# Vivado block design CE_128TR, xczu19eg-ffvc1760-2-i, Vivado 2024.2
# (continued, part 2 of 7)
current_bd_instance /EstNoise

create_bd_cell -type ip -vlnv xilinx.com:ip:xlconstant:1.1 gnd1
set_property -dict {CONFIG.CONST_VAL 0 CONFIG.CONST_WIDTH 1} [get_bd_cells gnd1]
create_bd_cell -type module -reference EstNoise EstNoise_0
set_property -dict {CONFIG.PARA 16 CONFIG.PORT 2} [get_bd_cells EstNoise_0]
create_bd_cell -type module -reference EstNoise EstNoise_1
set_property -dict {CONFIG.PARA 16 CONFIG.PORT 2} [get_bd_cells EstNoise_1]
create_bd_cell -type module -reference EstNoise EstNoise_2
set_property -dict {CONFIG.PARA 16 CONFIG.PORT 2} [get_bd_cells EstNoise_2]
create_bd_cell -type module -reference EstNoise EstNoise_3
set_property -dict {CONFIG.PARA 16 CONFIG.PORT 2} [get_bd_cells EstNoise_3]
create_bd_cell -type module -reference EstNoise EstNoise_4
set_property -dict {CONFIG.PARA 16 CONFIG.PORT 2} [get_bd_cells EstNoise_4]
create_bd_cell -type module -reference EstNoise EstNoise_5
set_property -dict {CONFIG.PARA 16 CONFIG.PORT 2} [get_bd_cells EstNoise_5]
create_bd_cell -type module -reference EstNoise EstNoise_6
set_property -dict {CONFIG.PARA 16 CONFIG.PORT 2} [get_bd_cells EstNoise_6]
create_bd_cell -type module -reference EstNoise EstNoise_7
set_property -dict {CONFIG.PARA 16 CONFIG.PORT 2} [get_bd_cells EstNoise_7]

# ---- hierarchy /Aveg_noise ----
current_bd_instance /Aveg_noise
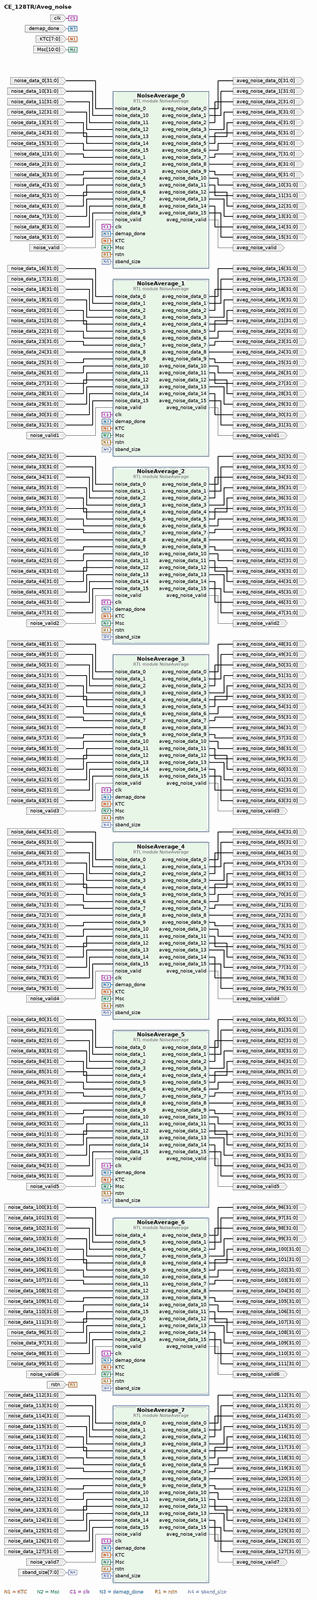
[diagram p20: block diagram inside /Aveg_noise, whole]
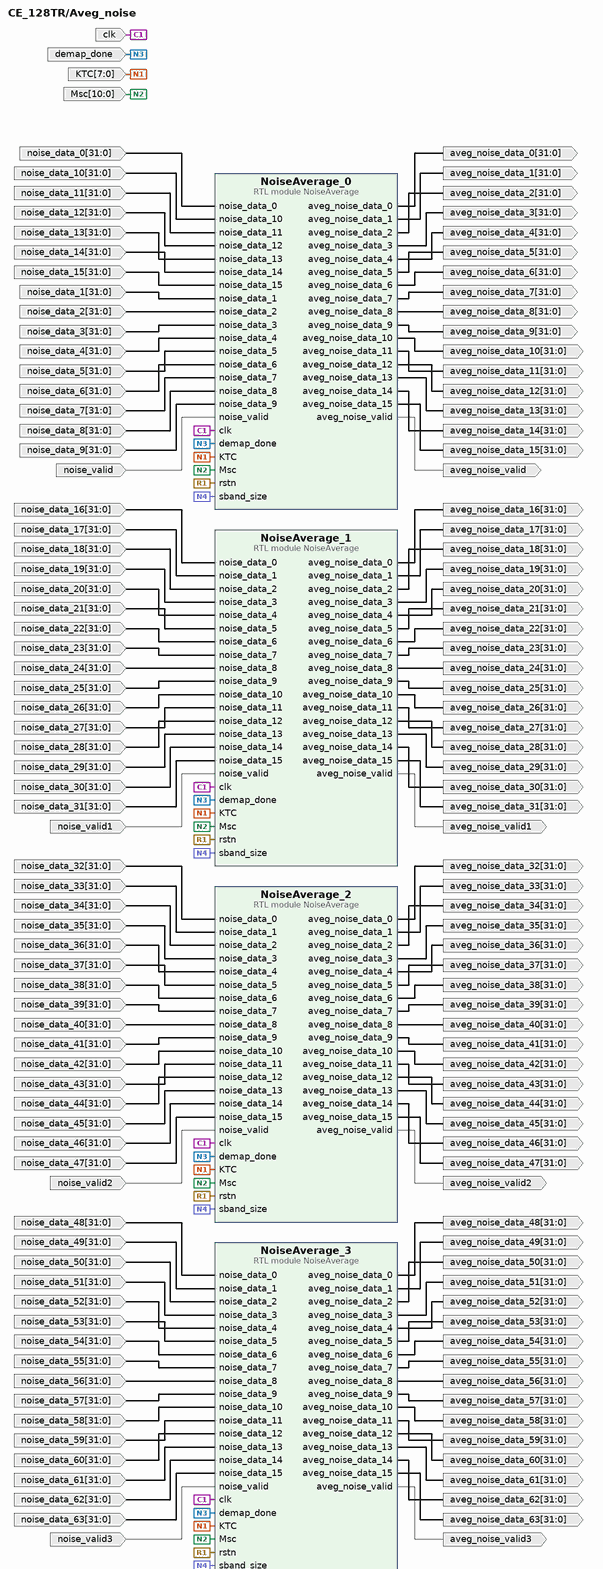
[diagram p21: block diagram inside /Aveg_noise, upper part]
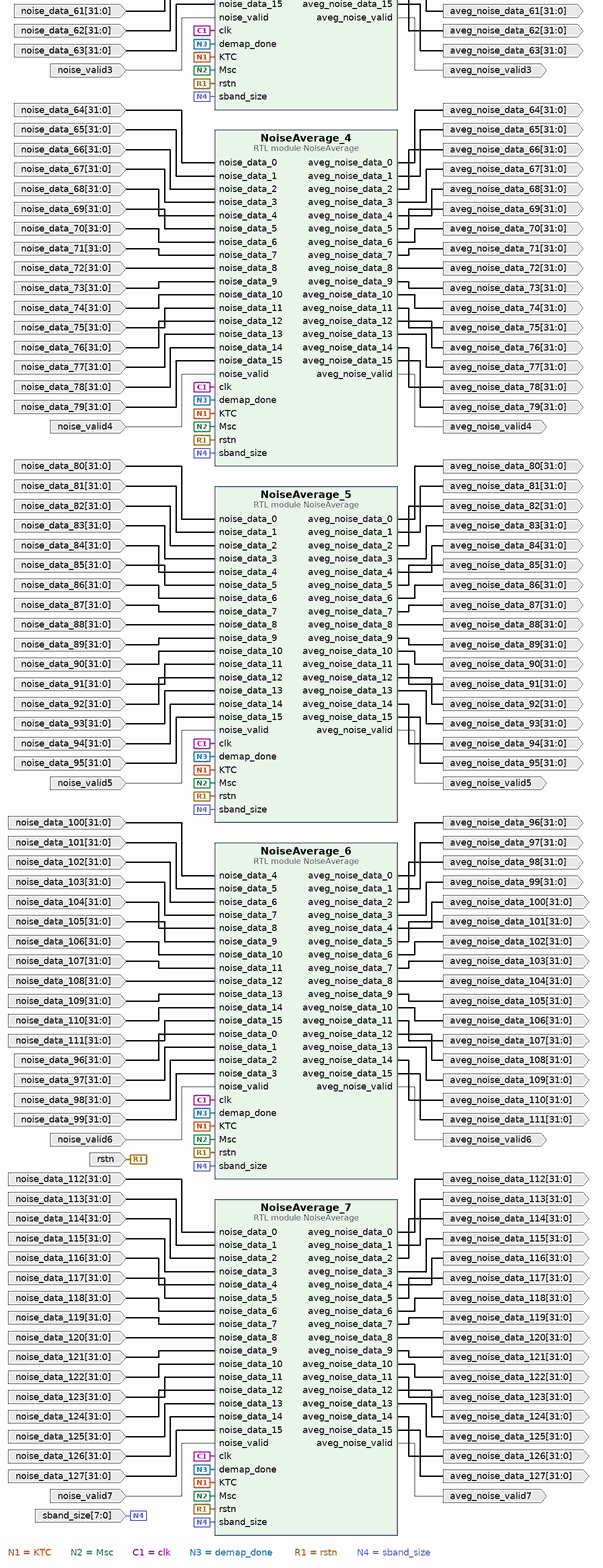
[diagram p22: block diagram inside /Aveg_noise, lower part]
create_bd_pin -dir I -type clk clk
create_bd_pin -dir I -type rst rstn
create_bd_pin -dir I demap_done
create_bd_pin -dir I -from 7 -to 0 sband_size
create_bd_pin -dir I -from 7 -to 0 KTC
create_bd_pin -dir I -from 10 -to 0 Msc
create_bd_pin -dir I noise_valid
create_bd_pin -dir I -from 31 -to 0 noise_data_0
create_bd_pin -dir I -from 31 -to 0 noise_data_1
create_bd_pin -dir I -from 31 -to 0 noise_data_2
create_bd_pin -dir I -from 31 -to 0 noise_data_3
create_bd_pin -dir I -from 31 -to 0 noise_data_4
create_bd_pin -dir I -from 31 -to 0 noise_data_5
create_bd_pin -dir I -from 31 -to 0 noise_data_6
create_bd_pin -dir I -from 31 -to 0 noise_data_7
create_bd_pin -dir I -from 31 -to 0 noise_data_8
create_bd_pin -dir I -from 31 -to 0 noise_data_9
create_bd_pin -dir I -from 31 -to 0 noise_data_10
create_bd_pin -dir I -from 31 -to 0 noise_data_11
create_bd_pin -dir I -from 31 -to 0 noise_data_12
create_bd_pin -dir I -from 31 -to 0 noise_data_13
create_bd_pin -dir I -from 31 -to 0 noise_data_14
create_bd_pin -dir I -from 31 -to 0 noise_data_15
create_bd_pin -dir I noise_valid1
create_bd_pin -dir I -from 31 -to 0 noise_data_16
create_bd_pin -dir I -from 31 -to 0 noise_data_17
create_bd_pin -dir I -from 31 -to 0 noise_data_18
create_bd_pin -dir I -from 31 -to 0 noise_data_19
create_bd_pin -dir I -from 31 -to 0 noise_data_20
create_bd_pin -dir I -from 31 -to 0 noise_data_21
create_bd_pin -dir I -from 31 -to 0 noise_data_22
create_bd_pin -dir I -from 31 -to 0 noise_data_23
create_bd_pin -dir I -from 31 -to 0 noise_data_24
create_bd_pin -dir I -from 31 -to 0 noise_data_25
create_bd_pin -dir I -from 31 -to 0 noise_data_26
create_bd_pin -dir I -from 31 -to 0 noise_data_27
create_bd_pin -dir I -from 31 -to 0 noise_data_28
create_bd_pin -dir I -from 31 -to 0 noise_data_29
create_bd_pin -dir I -from 31 -to 0 noise_data_30
create_bd_pin -dir I -from 31 -to 0 noise_data_31
create_bd_pin -dir I noise_valid2
create_bd_pin -dir I -from 31 -to 0 noise_data_32
create_bd_pin -dir I -from 31 -to 0 noise_data_33
create_bd_pin -dir I -from 31 -to 0 noise_data_34
create_bd_pin -dir I -from 31 -to 0 noise_data_35
create_bd_pin -dir I -from 31 -to 0 noise_data_36
create_bd_pin -dir I -from 31 -to 0 noise_data_37
create_bd_pin -dir I -from 31 -to 0 noise_data_38
create_bd_pin -dir I -from 31 -to 0 noise_data_39
create_bd_pin -dir I -from 31 -to 0 noise_data_40
create_bd_pin -dir I -from 31 -to 0 noise_data_41
create_bd_pin -dir I -from 31 -to 0 noise_data_42
create_bd_pin -dir I -from 31 -to 0 noise_data_43
create_bd_pin -dir I -from 31 -to 0 noise_data_44
create_bd_pin -dir I -from 31 -to 0 noise_data_45
create_bd_pin -dir I -from 31 -to 0 noise_data_46
create_bd_pin -dir I -from 31 -to 0 noise_data_47
create_bd_pin -dir I noise_valid3
create_bd_pin -dir I -from 31 -to 0 noise_data_48
create_bd_pin -dir I -from 31 -to 0 noise_data_49
create_bd_pin -dir I -from 31 -to 0 noise_data_50
create_bd_pin -dir I -from 31 -to 0 noise_data_51
create_bd_pin -dir I -from 31 -to 0 noise_data_52
create_bd_pin -dir I -from 31 -to 0 noise_data_53
create_bd_pin -dir I -from 31 -to 0 noise_data_54
create_bd_pin -dir I -from 31 -to 0 noise_data_55
create_bd_pin -dir I -from 31 -to 0 noise_data_56
create_bd_pin -dir I -from 31 -to 0 noise_data_57
create_bd_pin -dir I -from 31 -to 0 noise_data_58
create_bd_pin -dir I -from 31 -to 0 noise_data_59
create_bd_pin -dir I -from 31 -to 0 noise_data_60
create_bd_pin -dir I -from 31 -to 0 noise_data_61
create_bd_pin -dir I -from 31 -to 0 noise_data_62
create_bd_pin -dir I -from 31 -to 0 noise_data_63
create_bd_pin -dir I noise_valid4
create_bd_pin -dir I -from 31 -to 0 noise_data_64
create_bd_pin -dir I -from 31 -to 0 noise_data_65
create_bd_pin -dir I -from 31 -to 0 noise_data_66
create_bd_pin -dir I -from 31 -to 0 noise_data_67
create_bd_pin -dir I -from 31 -to 0 noise_data_68
create_bd_pin -dir I -from 31 -to 0 noise_data_69
create_bd_pin -dir I -from 31 -to 0 noise_data_70
create_bd_pin -dir I -from 31 -to 0 noise_data_71
create_bd_pin -dir I -from 31 -to 0 noise_data_72
create_bd_pin -dir I -from 31 -to 0 noise_data_73
create_bd_pin -dir I -from 31 -to 0 noise_data_74
create_bd_pin -dir I -from 31 -to 0 noise_data_75
create_bd_pin -dir I -from 31 -to 0 noise_data_76
create_bd_pin -dir I -from 31 -to 0 noise_data_77
create_bd_pin -dir I -from 31 -to 0 noise_data_78
create_bd_pin -dir I -from 31 -to 0 noise_data_79
create_bd_pin -dir I noise_valid5
create_bd_pin -dir I -from 31 -to 0 noise_data_80
create_bd_pin -dir I -from 31 -to 0 noise_data_81
create_bd_pin -dir I -from 31 -to 0 noise_data_82
create_bd_pin -dir I -from 31 -to 0 noise_data_83
create_bd_pin -dir I -from 31 -to 0 noise_data_84
create_bd_pin -dir I -from 31 -to 0 noise_data_85
create_bd_pin -dir I -from 31 -to 0 noise_data_86
create_bd_pin -dir I -from 31 -to 0 noise_data_87
create_bd_pin -dir I -from 31 -to 0 noise_data_88
create_bd_pin -dir I -from 31 -to 0 noise_data_89
create_bd_pin -dir I -from 31 -to 0 noise_data_90
create_bd_pin -dir I -from 31 -to 0 noise_data_91
create_bd_pin -dir I -from 31 -to 0 noise_data_92
create_bd_pin -dir I -from 31 -to 0 noise_data_93
create_bd_pin -dir I -from 31 -to 0 noise_data_94
create_bd_pin -dir I -from 31 -to 0 noise_data_95
create_bd_pin -dir I noise_valid6
create_bd_pin -dir I -from 31 -to 0 noise_data_96
create_bd_pin -dir I -from 31 -to 0 noise_data_97
create_bd_pin -dir I -from 31 -to 0 noise_data_98
create_bd_pin -dir I -from 31 -to 0 noise_data_99
create_bd_pin -dir I -from 31 -to 0 noise_data_100
create_bd_pin -dir I -from 31 -to 0 noise_data_101
create_bd_pin -dir I -from 31 -to 0 noise_data_102
create_bd_pin -dir I -from 31 -to 0 noise_data_103
create_bd_pin -dir I -from 31 -to 0 noise_data_104
create_bd_pin -dir I -from 31 -to 0 noise_data_105
create_bd_pin -dir I -from 31 -to 0 noise_data_106
create_bd_pin -dir I -from 31 -to 0 noise_data_107
create_bd_pin -dir I -from 31 -to 0 noise_data_108
create_bd_pin -dir I -from 31 -to 0 noise_data_109
create_bd_pin -dir I -from 31 -to 0 noise_data_110
create_bd_pin -dir I -from 31 -to 0 noise_data_111
create_bd_pin -dir I noise_valid7
create_bd_pin -dir I -from 31 -to 0 noise_data_112
create_bd_pin -dir I -from 31 -to 0 noise_data_113
create_bd_pin -dir I -from 31 -to 0 noise_data_114
create_bd_pin -dir I -from 31 -to 0 noise_data_115
create_bd_pin -dir I -from 31 -to 0 noise_data_116
create_bd_pin -dir I -from 31 -to 0 noise_data_117
create_bd_pin -dir I -from 31 -to 0 noise_data_118
create_bd_pin -dir I -from 31 -to 0 noise_data_119
create_bd_pin -dir I -from 31 -to 0 noise_data_120
create_bd_pin -dir I -from 31 -to 0 noise_data_121
create_bd_pin -dir I -from 31 -to 0 noise_data_122
create_bd_pin -dir I -from 31 -to 0 noise_data_123
create_bd_pin -dir I -from 31 -to 0 noise_data_124
create_bd_pin -dir I -from 31 -to 0 noise_data_125
create_bd_pin -dir I -from 31 -to 0 noise_data_126
create_bd_pin -dir I -from 31 -to 0 noise_data_127
create_bd_pin -dir O aveg_noise_valid
create_bd_pin -dir O -from 31 -to 0 aveg_noise_data_0
create_bd_pin -dir O -from 31 -to 0 aveg_noise_data_1
create_bd_pin -dir O -from 31 -to 0 aveg_noise_data_2
create_bd_pin -dir O -from 31 -to 0 aveg_noise_data_3
create_bd_pin -dir O -from 31 -to 0 aveg_noise_data_4
create_bd_pin -dir O -from 31 -to 0 aveg_noise_data_5
create_bd_pin -dir O -from 31 -to 0 aveg_noise_data_6
create_bd_pin -dir O -from 31 -to 0 aveg_noise_data_7
create_bd_pin -dir O -from 31 -to 0 aveg_noise_data_8
create_bd_pin -dir O -from 31 -to 0 aveg_noise_data_9
create_bd_pin -dir O -from 31 -to 0 aveg_noise_data_10
create_bd_pin -dir O -from 31 -to 0 aveg_noise_data_11
create_bd_pin -dir O -from 31 -to 0 aveg_noise_data_12
create_bd_pin -dir O -from 31 -to 0 aveg_noise_data_13
create_bd_pin -dir O -from 31 -to 0 aveg_noise_data_14
create_bd_pin -dir O -from 31 -to 0 aveg_noise_data_15
create_bd_pin -dir O aveg_noise_valid1
create_bd_pin -dir O -from 31 -to 0 aveg_noise_data_16
create_bd_pin -dir O -from 31 -to 0 aveg_noise_data_17
create_bd_pin -dir O -from 31 -to 0 aveg_noise_data_18
create_bd_pin -dir O -from 31 -to 0 aveg_noise_data_19
create_bd_pin -dir O -from 31 -to 0 aveg_noise_data_20
create_bd_pin -dir O -from 31 -to 0 aveg_noise_data_21
create_bd_pin -dir O -from 31 -to 0 aveg_noise_data_22
create_bd_pin -dir O -from 31 -to 0 aveg_noise_data_23
create_bd_pin -dir O -from 31 -to 0 aveg_noise_data_24
create_bd_pin -dir O -from 31 -to 0 aveg_noise_data_25
create_bd_pin -dir O -from 31 -to 0 aveg_noise_data_26
create_bd_pin -dir O -from 31 -to 0 aveg_noise_data_27
create_bd_pin -dir O -from 31 -to 0 aveg_noise_data_28
create_bd_pin -dir O -from 31 -to 0 aveg_noise_data_29
create_bd_pin -dir O -from 31 -to 0 aveg_noise_data_30
create_bd_pin -dir O -from 31 -to 0 aveg_noise_data_31
create_bd_pin -dir O aveg_noise_valid2
create_bd_pin -dir O -from 31 -to 0 aveg_noise_data_32
create_bd_pin -dir O -from 31 -to 0 aveg_noise_data_33
create_bd_pin -dir O -from 31 -to 0 aveg_noise_data_34
create_bd_pin -dir O -from 31 -to 0 aveg_noise_data_35
create_bd_pin -dir O -from 31 -to 0 aveg_noise_data_36
create_bd_pin -dir O -from 31 -to 0 aveg_noise_data_37
create_bd_pin -dir O -from 31 -to 0 aveg_noise_data_38
create_bd_pin -dir O -from 31 -to 0 aveg_noise_data_39
create_bd_pin -dir O -from 31 -to 0 aveg_noise_data_40
create_bd_pin -dir O -from 31 -to 0 aveg_noise_data_41
create_bd_pin -dir O -from 31 -to 0 aveg_noise_data_42
create_bd_pin -dir O -from 31 -to 0 aveg_noise_data_43
create_bd_pin -dir O -from 31 -to 0 aveg_noise_data_44
create_bd_pin -dir O -from 31 -to 0 aveg_noise_data_45
create_bd_pin -dir O -from 31 -to 0 aveg_noise_data_46
create_bd_pin -dir O -from 31 -to 0 aveg_noise_data_47
create_bd_pin -dir O aveg_noise_valid3
create_bd_pin -dir O -from 31 -to 0 aveg_noise_data_48
create_bd_pin -dir O -from 31 -to 0 aveg_noise_data_49
create_bd_pin -dir O -from 31 -to 0 aveg_noise_data_50
create_bd_pin -dir O -from 31 -to 0 aveg_noise_data_51
create_bd_pin -dir O -from 31 -to 0 aveg_noise_data_52
create_bd_pin -dir O -from 31 -to 0 aveg_noise_data_53
create_bd_pin -dir O -from 31 -to 0 aveg_noise_data_54
create_bd_pin -dir O -from 31 -to 0 aveg_noise_data_55
create_bd_pin -dir O -from 31 -to 0 aveg_noise_data_56
create_bd_pin -dir O -from 31 -to 0 aveg_noise_data_57
create_bd_pin -dir O -from 31 -to 0 aveg_noise_data_58
create_bd_pin -dir O -from 31 -to 0 aveg_noise_data_59
create_bd_pin -dir O -from 31 -to 0 aveg_noise_data_60
create_bd_pin -dir O -from 31 -to 0 aveg_noise_data_61
create_bd_pin -dir O -from 31 -to 0 aveg_noise_data_62
create_bd_pin -dir O -from 31 -to 0 aveg_noise_data_63
create_bd_pin -dir O aveg_noise_valid4
create_bd_pin -dir O -from 31 -to 0 aveg_noise_data_64
create_bd_pin -dir O -from 31 -to 0 aveg_noise_data_65
create_bd_pin -dir O -from 31 -to 0 aveg_noise_data_66
create_bd_pin -dir O -from 31 -to 0 aveg_noise_data_67
create_bd_pin -dir O -from 31 -to 0 aveg_noise_data_68
create_bd_pin -dir O -from 31 -to 0 aveg_noise_data_69
create_bd_pin -dir O -from 31 -to 0 aveg_noise_data_70
create_bd_pin -dir O -from 31 -to 0 aveg_noise_data_71
create_bd_pin -dir O -from 31 -to 0 aveg_noise_data_72
create_bd_pin -dir O -from 31 -to 0 aveg_noise_data_73
create_bd_pin -dir O -from 31 -to 0 aveg_noise_data_74
create_bd_pin -dir O -from 31 -to 0 aveg_noise_data_75
create_bd_pin -dir O -from 31 -to 0 aveg_noise_data_76
create_bd_pin -dir O -from 31 -to 0 aveg_noise_data_77
create_bd_pin -dir O -from 31 -to 0 aveg_noise_data_78
create_bd_pin -dir O -from 31 -to 0 aveg_noise_data_79
create_bd_pin -dir O aveg_noise_valid5
create_bd_pin -dir O -from 31 -to 0 aveg_noise_data_80
create_bd_pin -dir O -from 31 -to 0 aveg_noise_data_81
create_bd_pin -dir O -from 31 -to 0 aveg_noise_data_82
create_bd_pin -dir O -from 31 -to 0 aveg_noise_data_83
create_bd_pin -dir O -from 31 -to 0 aveg_noise_data_84
create_bd_pin -dir O -from 31 -to 0 aveg_noise_data_85
create_bd_pin -dir O -from 31 -to 0 aveg_noise_data_86
create_bd_pin -dir O -from 31 -to 0 aveg_noise_data_87
create_bd_pin -dir O -from 31 -to 0 aveg_noise_data_88
create_bd_pin -dir O -from 31 -to 0 aveg_noise_data_89
create_bd_pin -dir O -from 31 -to 0 aveg_noise_data_90
create_bd_pin -dir O -from 31 -to 0 aveg_noise_data_91
create_bd_pin -dir O -from 31 -to 0 aveg_noise_data_92
create_bd_pin -dir O -from 31 -to 0 aveg_noise_data_93
create_bd_pin -dir O -from 31 -to 0 aveg_noise_data_94
create_bd_pin -dir O -from 31 -to 0 aveg_noise_data_95
create_bd_pin -dir O aveg_noise_valid6
create_bd_pin -dir O -from 31 -to 0 aveg_noise_data_96
create_bd_pin -dir O -from 31 -to 0 aveg_noise_data_97
create_bd_pin -dir O -from 31 -to 0 aveg_noise_data_98
create_bd_pin -dir O -from 31 -to 0 aveg_noise_data_99
create_bd_pin -dir O -from 31 -to 0 aveg_noise_data_100
create_bd_pin -dir O -from 31 -to 0 aveg_noise_data_101
create_bd_pin -dir O -from 31 -to 0 aveg_noise_data_102
create_bd_pin -dir O -from 31 -to 0 aveg_noise_data_103
create_bd_pin -dir O -from 31 -to 0 aveg_noise_data_104
create_bd_pin -dir O -from 31 -to 0 aveg_noise_data_105
create_bd_pin -dir O -from 31 -to 0 aveg_noise_data_106
create_bd_pin -dir O -from 31 -to 0 aveg_noise_data_107
create_bd_pin -dir O -from 31 -to 0 aveg_noise_data_108
create_bd_pin -dir O -from 31 -to 0 aveg_noise_data_109
create_bd_pin -dir O -from 31 -to 0 aveg_noise_data_110
create_bd_pin -dir O -from 31 -to 0 aveg_noise_data_111
create_bd_pin -dir O aveg_noise_valid7
create_bd_pin -dir O -from 31 -to 0 aveg_noise_data_112
create_bd_pin -dir O -from 31 -to 0 aveg_noise_data_113
create_bd_pin -dir O -from 31 -to 0 aveg_noise_data_114
create_bd_pin -dir O -from 31 -to 0 aveg_noise_data_115
create_bd_pin -dir O -from 31 -to 0 aveg_noise_data_116
create_bd_pin -dir O -from 31 -to 0 aveg_noise_data_117
create_bd_pin -dir O -from 31 -to 0 aveg_noise_data_118
create_bd_pin -dir O -from 31 -to 0 aveg_noise_data_119
create_bd_pin -dir O -from 31 -to 0 aveg_noise_data_120
create_bd_pin -dir O -from 31 -to 0 aveg_noise_data_121
create_bd_pin -dir O -from 31 -to 0 aveg_noise_data_122
create_bd_pin -dir O -from 31 -to 0 aveg_noise_data_123
create_bd_pin -dir O -from 31 -to 0 aveg_noise_data_124
create_bd_pin -dir O -from 31 -to 0 aveg_noise_data_125
create_bd_pin -dir O -from 31 -to 0 aveg_noise_data_126
create_bd_pin -dir O -from 31 -to 0 aveg_noise_data_127

create_bd_cell -type module -reference NoiseAverage NoiseAverage_0
set_property -dict {CONFIG.PARA 16} [get_bd_cells NoiseAverage_0]
create_bd_cell -type module -reference NoiseAverage NoiseAverage_1
set_property -dict {CONFIG.PARA 16} [get_bd_cells NoiseAverage_1]
create_bd_cell -type module -reference NoiseAverage NoiseAverage_2
set_property -dict {CONFIG.PARA 16} [get_bd_cells NoiseAverage_2]
create_bd_cell -type module -reference NoiseAverage NoiseAverage_3
set_property -dict {CONFIG.PARA 16} [get_bd_cells NoiseAverage_3]
create_bd_cell -type module -reference NoiseAverage NoiseAverage_4
set_property -dict {CONFIG.PARA 16} [get_bd_cells NoiseAverage_4]
create_bd_cell -type module -reference NoiseAverage NoiseAverage_5
set_property -dict {CONFIG.PARA 16} [get_bd_cells NoiseAverage_5]
create_bd_cell -type module -reference NoiseAverage NoiseAverage_6
set_property -dict {CONFIG.PARA 16} [get_bd_cells NoiseAverage_6]
create_bd_cell -type module -reference NoiseAverage NoiseAverage_7
set_property -dict {CONFIG.PARA 16} [get_bd_cells NoiseAverage_7]

# ---- hierarchy /ChannelNorm ----
current_bd_instance /ChannelNorm
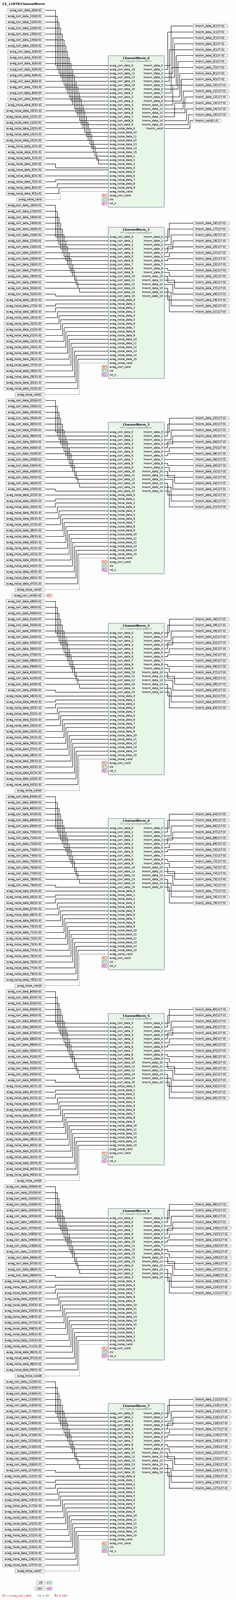
[diagram p23: block diagram inside /ChannelNorm, whole]
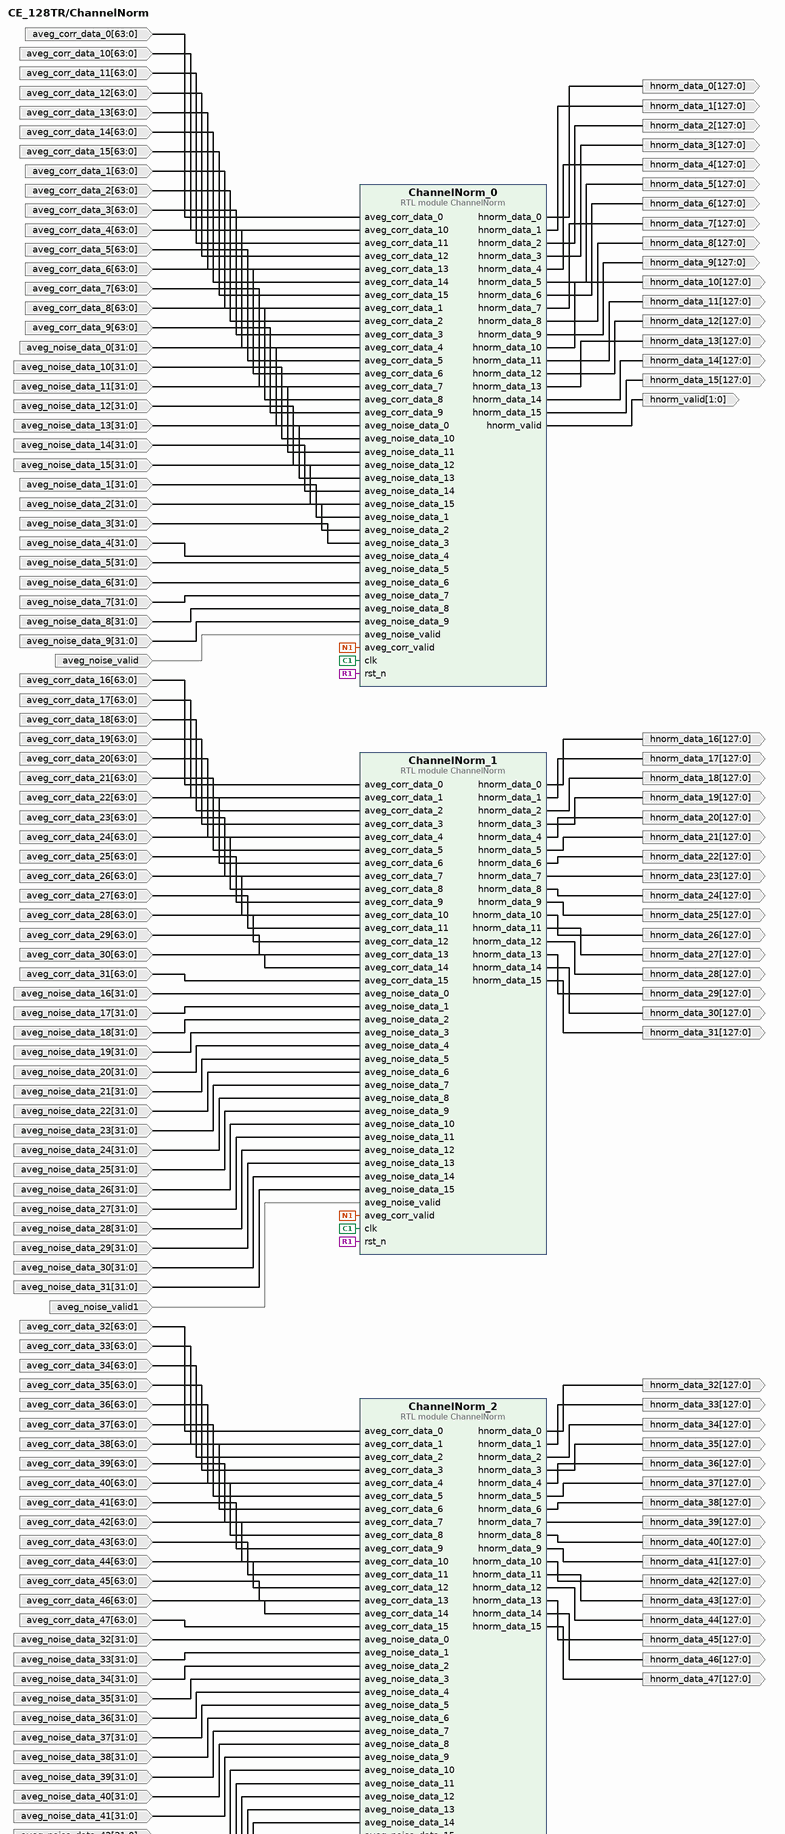
[diagram p24: block diagram inside /ChannelNorm, upper part]
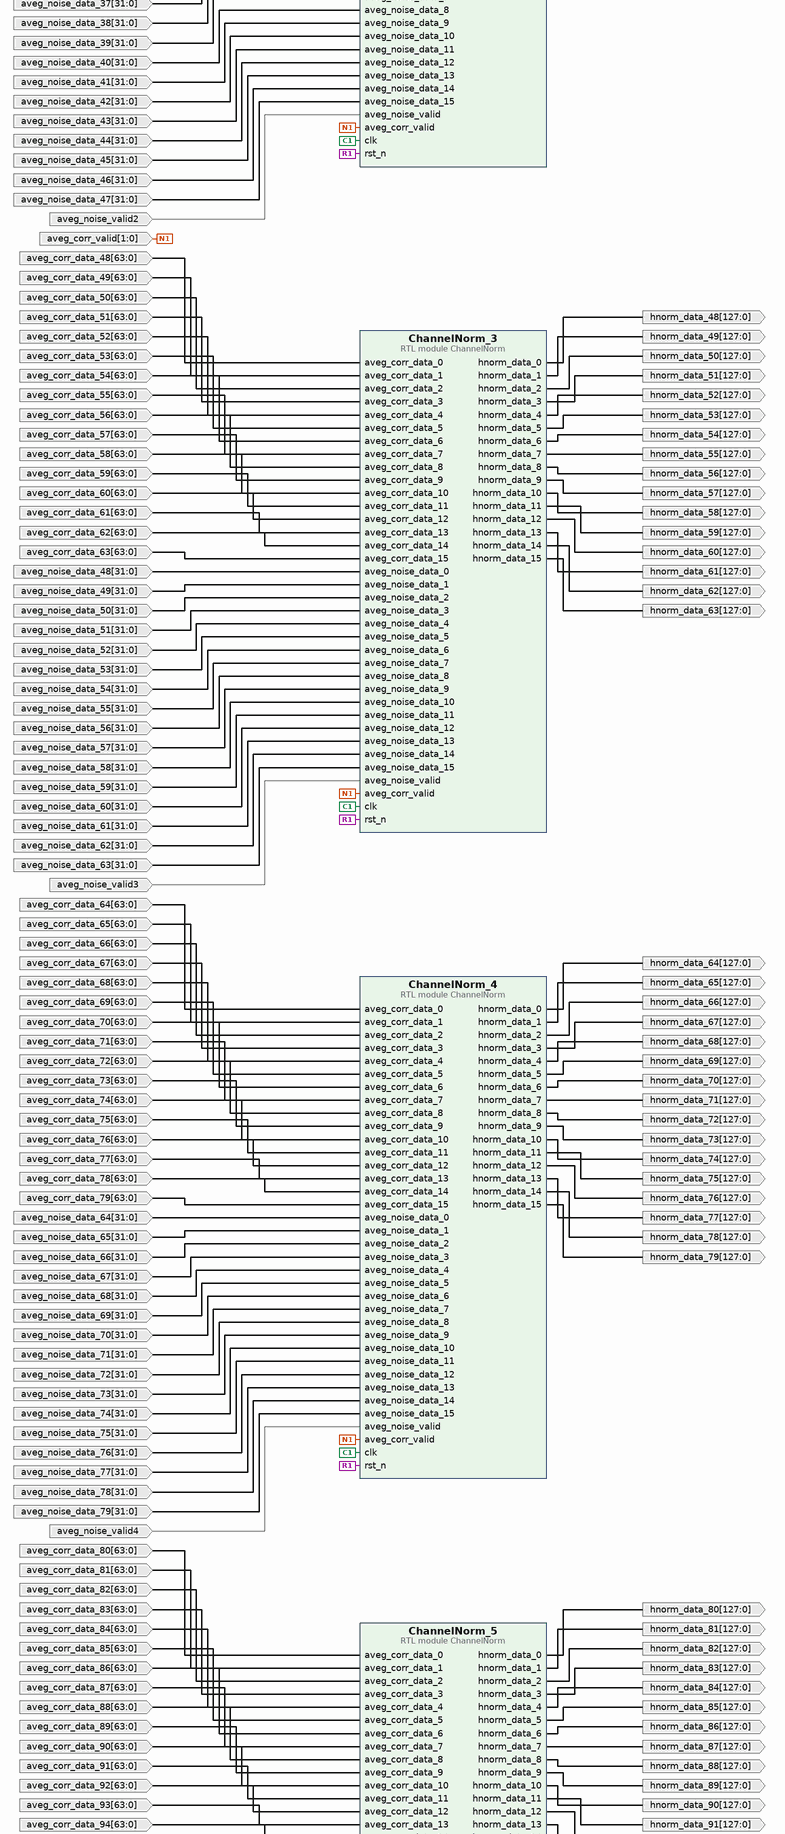
[diagram p25: block diagram inside /ChannelNorm, middle part]
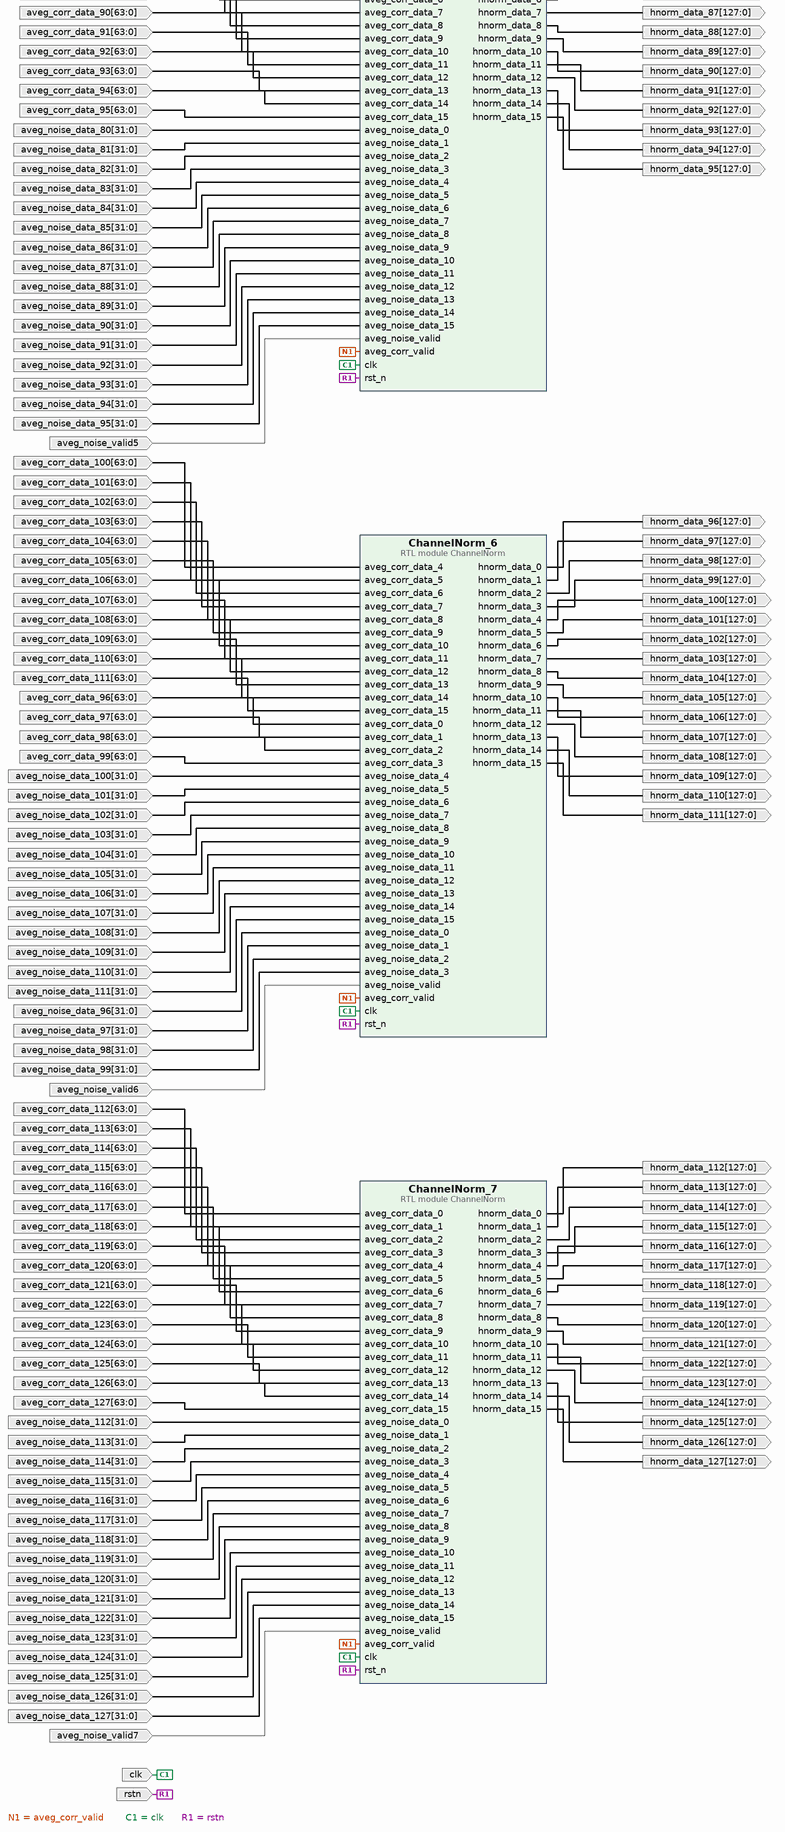
[diagram p26: block diagram inside /ChannelNorm, lower part]
create_bd_pin -dir I -type clk clk
create_bd_pin -dir I -type rst rstn
create_bd_pin -dir I -from 1 -to 0 aveg_corr_valid
create_bd_pin -dir I -from 63 -to 0 aveg_corr_data_0
create_bd_pin -dir I -from 63 -to 0 aveg_corr_data_1
create_bd_pin -dir I -from 63 -to 0 aveg_corr_data_2
create_bd_pin -dir I -from 63 -to 0 aveg_corr_data_3
create_bd_pin -dir I -from 63 -to 0 aveg_corr_data_4
create_bd_pin -dir I -from 63 -to 0 aveg_corr_data_5
create_bd_pin -dir I -from 63 -to 0 aveg_corr_data_6
create_bd_pin -dir I -from 63 -to 0 aveg_corr_data_7
create_bd_pin -dir I -from 63 -to 0 aveg_corr_data_8
create_bd_pin -dir I -from 63 -to 0 aveg_corr_data_9
create_bd_pin -dir I -from 63 -to 0 aveg_corr_data_10
create_bd_pin -dir I -from 63 -to 0 aveg_corr_data_11
create_bd_pin -dir I -from 63 -to 0 aveg_corr_data_12
create_bd_pin -dir I -from 63 -to 0 aveg_corr_data_13
create_bd_pin -dir I -from 63 -to 0 aveg_corr_data_14
create_bd_pin -dir I -from 63 -to 0 aveg_corr_data_15
create_bd_pin -dir I aveg_noise_valid
create_bd_pin -dir I -from 31 -to 0 aveg_noise_data_0
create_bd_pin -dir I -from 31 -to 0 aveg_noise_data_1
create_bd_pin -dir I -from 31 -to 0 aveg_noise_data_2
create_bd_pin -dir I -from 31 -to 0 aveg_noise_data_3
create_bd_pin -dir I -from 31 -to 0 aveg_noise_data_4
create_bd_pin -dir I -from 31 -to 0 aveg_noise_data_5
create_bd_pin -dir I -from 31 -to 0 aveg_noise_data_6
create_bd_pin -dir I -from 31 -to 0 aveg_noise_data_7
create_bd_pin -dir I -from 31 -to 0 aveg_noise_data_8
create_bd_pin -dir I -from 31 -to 0 aveg_noise_data_9
create_bd_pin -dir I -from 31 -to 0 aveg_noise_data_10
create_bd_pin -dir I -from 31 -to 0 aveg_noise_data_11
create_bd_pin -dir I -from 31 -to 0 aveg_noise_data_12
create_bd_pin -dir I -from 31 -to 0 aveg_noise_data_13
create_bd_pin -dir I -from 31 -to 0 aveg_noise_data_14
create_bd_pin -dir I -from 31 -to 0 aveg_noise_data_15
create_bd_pin -dir I -from 63 -to 0 aveg_corr_data_16
create_bd_pin -dir I -from 63 -to 0 aveg_corr_data_17
create_bd_pin -dir I -from 63 -to 0 aveg_corr_data_18
create_bd_pin -dir I -from 63 -to 0 aveg_corr_data_19
create_bd_pin -dir I -from 63 -to 0 aveg_corr_data_20
create_bd_pin -dir I -from 63 -to 0 aveg_corr_data_21
create_bd_pin -dir I -from 63 -to 0 aveg_corr_data_22
create_bd_pin -dir I -from 63 -to 0 aveg_corr_data_23
create_bd_pin -dir I -from 63 -to 0 aveg_corr_data_24
create_bd_pin -dir I -from 63 -to 0 aveg_corr_data_25
create_bd_pin -dir I -from 63 -to 0 aveg_corr_data_26
create_bd_pin -dir I -from 63 -to 0 aveg_corr_data_27
create_bd_pin -dir I -from 63 -to 0 aveg_corr_data_28
create_bd_pin -dir I -from 63 -to 0 aveg_corr_data_29
create_bd_pin -dir I -from 63 -to 0 aveg_corr_data_30
create_bd_pin -dir I -from 63 -to 0 aveg_corr_data_31
create_bd_pin -dir I aveg_noise_valid1
create_bd_pin -dir I -from 31 -to 0 aveg_noise_data_16
create_bd_pin -dir I -from 31 -to 0 aveg_noise_data_17
create_bd_pin -dir I -from 31 -to 0 aveg_noise_data_18
create_bd_pin -dir I -from 31 -to 0 aveg_noise_data_19
create_bd_pin -dir I -from 31 -to 0 aveg_noise_data_20
create_bd_pin -dir I -from 31 -to 0 aveg_noise_data_21
create_bd_pin -dir I -from 31 -to 0 aveg_noise_data_22
create_bd_pin -dir I -from 31 -to 0 aveg_noise_data_23
create_bd_pin -dir I -from 31 -to 0 aveg_noise_data_24
create_bd_pin -dir I -from 31 -to 0 aveg_noise_data_25
create_bd_pin -dir I -from 31 -to 0 aveg_noise_data_26
create_bd_pin -dir I -from 31 -to 0 aveg_noise_data_27
create_bd_pin -dir I -from 31 -to 0 aveg_noise_data_28
create_bd_pin -dir I -from 31 -to 0 aveg_noise_data_29
create_bd_pin -dir I -from 31 -to 0 aveg_noise_data_30
create_bd_pin -dir I -from 31 -to 0 aveg_noise_data_31
create_bd_pin -dir I -from 63 -to 0 aveg_corr_data_32
create_bd_pin -dir I -from 63 -to 0 aveg_corr_data_33
create_bd_pin -dir I -from 63 -to 0 aveg_corr_data_34
create_bd_pin -dir I -from 63 -to 0 aveg_corr_data_35
create_bd_pin -dir I -from 63 -to 0 aveg_corr_data_36
create_bd_pin -dir I -from 63 -to 0 aveg_corr_data_37
create_bd_pin -dir I -from 63 -to 0 aveg_corr_data_38
create_bd_pin -dir I -from 63 -to 0 aveg_corr_data_39
create_bd_pin -dir I -from 63 -to 0 aveg_corr_data_40
create_bd_pin -dir I -from 63 -to 0 aveg_corr_data_41
create_bd_pin -dir I -from 63 -to 0 aveg_corr_data_42
create_bd_pin -dir I -from 63 -to 0 aveg_corr_data_43
create_bd_pin -dir I -from 63 -to 0 aveg_corr_data_44
create_bd_pin -dir I -from 63 -to 0 aveg_corr_data_45
create_bd_pin -dir I -from 63 -to 0 aveg_corr_data_46
create_bd_pin -dir I -from 63 -to 0 aveg_corr_data_47
create_bd_pin -dir I aveg_noise_valid2
create_bd_pin -dir I -from 31 -to 0 aveg_noise_data_32
create_bd_pin -dir I -from 31 -to 0 aveg_noise_data_33
create_bd_pin -dir I -from 31 -to 0 aveg_noise_data_34
create_bd_pin -dir I -from 31 -to 0 aveg_noise_data_35
create_bd_pin -dir I -from 31 -to 0 aveg_noise_data_36
create_bd_pin -dir I -from 31 -to 0 aveg_noise_data_37
create_bd_pin -dir I -from 31 -to 0 aveg_noise_data_38
create_bd_pin -dir I -from 31 -to 0 aveg_noise_data_39
create_bd_pin -dir I -from 31 -to 0 aveg_noise_data_40
create_bd_pin -dir I -from 31 -to 0 aveg_noise_data_41
create_bd_pin -dir I -from 31 -to 0 aveg_noise_data_42
create_bd_pin -dir I -from 31 -to 0 aveg_noise_data_43
create_bd_pin -dir I -from 31 -to 0 aveg_noise_data_44
create_bd_pin -dir I -from 31 -to 0 aveg_noise_data_45
create_bd_pin -dir I -from 31 -to 0 aveg_noise_data_46
create_bd_pin -dir I -from 31 -to 0 aveg_noise_data_47
create_bd_pin -dir I -from 63 -to 0 aveg_corr_data_48
create_bd_pin -dir I -from 63 -to 0 aveg_corr_data_49
create_bd_pin -dir I -from 63 -to 0 aveg_corr_data_50
create_bd_pin -dir I -from 63 -to 0 aveg_corr_data_51
create_bd_pin -dir I -from 63 -to 0 aveg_corr_data_52
create_bd_pin -dir I -from 63 -to 0 aveg_corr_data_53
create_bd_pin -dir I -from 63 -to 0 aveg_corr_data_54
create_bd_pin -dir I -from 63 -to 0 aveg_corr_data_55
create_bd_pin -dir I -from 63 -to 0 aveg_corr_data_56
create_bd_pin -dir I -from 63 -to 0 aveg_corr_data_57
create_bd_pin -dir I -from 63 -to 0 aveg_corr_data_58
create_bd_pin -dir I -from 63 -to 0 aveg_corr_data_59
create_bd_pin -dir I -from 63 -to 0 aveg_corr_data_60
create_bd_pin -dir I -from 63 -to 0 aveg_corr_data_61
create_bd_pin -dir I -from 63 -to 0 aveg_corr_data_62
create_bd_pin -dir I -from 63 -to 0 aveg_corr_data_63
create_bd_pin -dir I aveg_noise_valid3
create_bd_pin -dir I -from 31 -to 0 aveg_noise_data_48
create_bd_pin -dir I -from 31 -to 0 aveg_noise_data_49
create_bd_pin -dir I -from 31 -to 0 aveg_noise_data_50
create_bd_pin -dir I -from 31 -to 0 aveg_noise_data_51
create_bd_pin -dir I -from 31 -to 0 aveg_noise_data_52
create_bd_pin -dir I -from 31 -to 0 aveg_noise_data_53
create_bd_pin -dir I -from 31 -to 0 aveg_noise_data_54
create_bd_pin -dir I -from 31 -to 0 aveg_noise_data_55
create_bd_pin -dir I -from 31 -to 0 aveg_noise_data_56
create_bd_pin -dir I -from 31 -to 0 aveg_noise_data_57
create_bd_pin -dir I -from 31 -to 0 aveg_noise_data_58
create_bd_pin -dir I -from 31 -to 0 aveg_noise_data_59
create_bd_pin -dir I -from 31 -to 0 aveg_noise_data_60
create_bd_pin -dir I -from 31 -to 0 aveg_noise_data_61
create_bd_pin -dir I -from 31 -to 0 aveg_noise_data_62
create_bd_pin -dir I -from 31 -to 0 aveg_noise_data_63
create_bd_pin -dir I -from 63 -to 0 aveg_corr_data_64
create_bd_pin -dir I -from 63 -to 0 aveg_corr_data_65
create_bd_pin -dir I -from 63 -to 0 aveg_corr_data_66
create_bd_pin -dir I -from 63 -to 0 aveg_corr_data_67
create_bd_pin -dir I -from 63 -to 0 aveg_corr_data_68
create_bd_pin -dir I -from 63 -to 0 aveg_corr_data_69
create_bd_pin -dir I -from 63 -to 0 aveg_corr_data_70
create_bd_pin -dir I -from 63 -to 0 aveg_corr_data_71
create_bd_pin -dir I -from 63 -to 0 aveg_corr_data_72
create_bd_pin -dir I -from 63 -to 0 aveg_corr_data_73
create_bd_pin -dir I -from 63 -to 0 aveg_corr_data_74
create_bd_pin -dir I -from 63 -to 0 aveg_corr_data_75
create_bd_pin -dir I -from 63 -to 0 aveg_corr_data_76
create_bd_pin -dir I -from 63 -to 0 aveg_corr_data_77
create_bd_pin -dir I -from 63 -to 0 aveg_corr_data_78
create_bd_pin -dir I -from 63 -to 0 aveg_corr_data_79
create_bd_pin -dir I aveg_noise_valid4
create_bd_pin -dir I -from 31 -to 0 aveg_noise_data_64
create_bd_pin -dir I -from 31 -to 0 aveg_noise_data_65
create_bd_pin -dir I -from 31 -to 0 aveg_noise_data_66
create_bd_pin -dir I -from 31 -to 0 aveg_noise_data_67
create_bd_pin -dir I -from 31 -to 0 aveg_noise_data_68
create_bd_pin -dir I -from 31 -to 0 aveg_noise_data_69
create_bd_pin -dir I -from 31 -to 0 aveg_noise_data_70
create_bd_pin -dir I -from 31 -to 0 aveg_noise_data_71
create_bd_pin -dir I -from 31 -to 0 aveg_noise_data_72
create_bd_pin -dir I -from 31 -to 0 aveg_noise_data_73
create_bd_pin -dir I -from 31 -to 0 aveg_noise_data_74
create_bd_pin -dir I -from 31 -to 0 aveg_noise_data_75
create_bd_pin -dir I -from 31 -to 0 aveg_noise_data_76
create_bd_pin -dir I -from 31 -to 0 aveg_noise_data_77
create_bd_pin -dir I -from 31 -to 0 aveg_noise_data_78
create_bd_pin -dir I -from 31 -to 0 aveg_noise_data_79
create_bd_pin -dir I -from 63 -to 0 aveg_corr_data_80
create_bd_pin -dir I -from 63 -to 0 aveg_corr_data_81
create_bd_pin -dir I -from 63 -to 0 aveg_corr_data_82
create_bd_pin -dir I -from 63 -to 0 aveg_corr_data_83
create_bd_pin -dir I -from 63 -to 0 aveg_corr_data_84
create_bd_pin -dir I -from 63 -to 0 aveg_corr_data_85
create_bd_pin -dir I -from 63 -to 0 aveg_corr_data_86
create_bd_pin -dir I -from 63 -to 0 aveg_corr_data_87
create_bd_pin -dir I -from 63 -to 0 aveg_corr_data_88
create_bd_pin -dir I -from 63 -to 0 aveg_corr_data_89
create_bd_pin -dir I -from 63 -to 0 aveg_corr_data_90
create_bd_pin -dir I -from 63 -to 0 aveg_corr_data_91
create_bd_pin -dir I -from 63 -to 0 aveg_corr_data_92
create_bd_pin -dir I -from 63 -to 0 aveg_corr_data_93
create_bd_pin -dir I -from 63 -to 0 aveg_corr_data_94
create_bd_pin -dir I -from 63 -to 0 aveg_corr_data_95
create_bd_pin -dir I aveg_noise_valid5
create_bd_pin -dir I -from 31 -to 0 aveg_noise_data_80
create_bd_pin -dir I -from 31 -to 0 aveg_noise_data_81
create_bd_pin -dir I -from 31 -to 0 aveg_noise_data_82
create_bd_pin -dir I -from 31 -to 0 aveg_noise_data_83
create_bd_pin -dir I -from 31 -to 0 aveg_noise_data_84
create_bd_pin -dir I -from 31 -to 0 aveg_noise_data_85
create_bd_pin -dir I -from 31 -to 0 aveg_noise_data_86
create_bd_pin -dir I -from 31 -to 0 aveg_noise_data_87
create_bd_pin -dir I -from 31 -to 0 aveg_noise_data_88
create_bd_pin -dir I -from 31 -to 0 aveg_noise_data_89
create_bd_pin -dir I -from 31 -to 0 aveg_noise_data_90
create_bd_pin -dir I -from 31 -to 0 aveg_noise_data_91
create_bd_pin -dir I -from 31 -to 0 aveg_noise_data_92
create_bd_pin -dir I -from 31 -to 0 aveg_noise_data_93
create_bd_pin -dir I -from 31 -to 0 aveg_noise_data_94
create_bd_pin -dir I -from 31 -to 0 aveg_noise_data_95
create_bd_pin -dir I -from 63 -to 0 aveg_corr_data_96
create_bd_pin -dir I -from 63 -to 0 aveg_corr_data_97
create_bd_pin -dir I -from 63 -to 0 aveg_corr_data_98
create_bd_pin -dir I -from 63 -to 0 aveg_corr_data_99
create_bd_pin -dir I -from 63 -to 0 aveg_corr_data_100
create_bd_pin -dir I -from 63 -to 0 aveg_corr_data_101
create_bd_pin -dir I -from 63 -to 0 aveg_corr_data_102
create_bd_pin -dir I -from 63 -to 0 aveg_corr_data_103
create_bd_pin -dir I -from 63 -to 0 aveg_corr_data_104
create_bd_pin -dir I -from 63 -to 0 aveg_corr_data_105
create_bd_pin -dir I -from 63 -to 0 aveg_corr_data_106
create_bd_pin -dir I -from 63 -to 0 aveg_corr_data_107
create_bd_pin -dir I -from 63 -to 0 aveg_corr_data_108
create_bd_pin -dir I -from 63 -to 0 aveg_corr_data_109
create_bd_pin -dir I -from 63 -to 0 aveg_corr_data_110
create_bd_pin -dir I -from 63 -to 0 aveg_corr_data_111
create_bd_pin -dir I aveg_noise_valid6
create_bd_pin -dir I -from 31 -to 0 aveg_noise_data_96
create_bd_pin -dir I -from 31 -to 0 aveg_noise_data_97
create_bd_pin -dir I -from 31 -to 0 aveg_noise_data_98
create_bd_pin -dir I -from 31 -to 0 aveg_noise_data_99
create_bd_pin -dir I -from 31 -to 0 aveg_noise_data_100
create_bd_pin -dir I -from 31 -to 0 aveg_noise_data_101
create_bd_pin -dir I -from 31 -to 0 aveg_noise_data_102
create_bd_pin -dir I -from 31 -to 0 aveg_noise_data_103
create_bd_pin -dir I -from 31 -to 0 aveg_noise_data_104
create_bd_pin -dir I -from 31 -to 0 aveg_noise_data_105
create_bd_pin -dir I -from 31 -to 0 aveg_noise_data_106
create_bd_pin -dir I -from 31 -to 0 aveg_noise_data_107
create_bd_pin -dir I -from 31 -to 0 aveg_noise_data_108
create_bd_pin -dir I -from 31 -to 0 aveg_noise_data_109
create_bd_pin -dir I -from 31 -to 0 aveg_noise_data_110
create_bd_pin -dir I -from 31 -to 0 aveg_noise_data_111
create_bd_pin -dir I -from 63 -to 0 aveg_corr_data_112
create_bd_pin -dir I -from 63 -to 0 aveg_corr_data_113
create_bd_pin -dir I -from 63 -to 0 aveg_corr_data_114
create_bd_pin -dir I -from 63 -to 0 aveg_corr_data_115
create_bd_pin -dir I -from 63 -to 0 aveg_corr_data_116
create_bd_pin -dir I -from 63 -to 0 aveg_corr_data_117
create_bd_pin -dir I -from 63 -to 0 aveg_corr_data_118
create_bd_pin -dir I -from 63 -to 0 aveg_corr_data_119
create_bd_pin -dir I -from 63 -to 0 aveg_corr_data_120
create_bd_pin -dir I -from 63 -to 0 aveg_corr_data_121
create_bd_pin -dir I -from 63 -to 0 aveg_corr_data_122
create_bd_pin -dir I -from 63 -to 0 aveg_corr_data_123
create_bd_pin -dir I -from 63 -to 0 aveg_corr_data_124
create_bd_pin -dir I -from 63 -to 0 aveg_corr_data_125
create_bd_pin -dir I -from 63 -to 0 aveg_corr_data_126
create_bd_pin -dir I -from 63 -to 0 aveg_corr_data_127
create_bd_pin -dir I aveg_noise_valid7
create_bd_pin -dir I -from 31 -to 0 aveg_noise_data_112
create_bd_pin -dir I -from 31 -to 0 aveg_noise_data_113
create_bd_pin -dir I -from 31 -to 0 aveg_noise_data_114
create_bd_pin -dir I -from 31 -to 0 aveg_noise_data_115
create_bd_pin -dir I -from 31 -to 0 aveg_noise_data_116
create_bd_pin -dir I -from 31 -to 0 aveg_noise_data_117
create_bd_pin -dir I -from 31 -to 0 aveg_noise_data_118
create_bd_pin -dir I -from 31 -to 0 aveg_noise_data_119
create_bd_pin -dir I -from 31 -to 0 aveg_noise_data_120
create_bd_pin -dir I -from 31 -to 0 aveg_noise_data_121
create_bd_pin -dir I -from 31 -to 0 aveg_noise_data_122
create_bd_pin -dir I -from 31 -to 0 aveg_noise_data_123
create_bd_pin -dir I -from 31 -to 0 aveg_noise_data_124
create_bd_pin -dir I -from 31 -to 0 aveg_noise_data_125
create_bd_pin -dir I -from 31 -to 0 aveg_noise_data_126
create_bd_pin -dir I -from 31 -to 0 aveg_noise_data_127
create_bd_pin -dir O -from 1 -to 0 hnorm_valid
create_bd_pin -dir O -from 127 -to 0 hnorm_data_0
create_bd_pin -dir O -from 127 -to 0 hnorm_data_1
create_bd_pin -dir O -from 127 -to 0 hnorm_data_2
create_bd_pin -dir O -from 127 -to 0 hnorm_data_3
create_bd_pin -dir O -from 127 -to 0 hnorm_data_4
create_bd_pin -dir O -from 127 -to 0 hnorm_data_5
create_bd_pin -dir O -from 127 -to 0 hnorm_data_6
create_bd_pin -dir O -from 127 -to 0 hnorm_data_7
create_bd_pin -dir O -from 127 -to 0 hnorm_data_8
create_bd_pin -dir O -from 127 -to 0 hnorm_data_9
create_bd_pin -dir O -from 127 -to 0 hnorm_data_10
create_bd_pin -dir O -from 127 -to 0 hnorm_data_11
create_bd_pin -dir O -from 127 -to 0 hnorm_data_12
create_bd_pin -dir O -from 127 -to 0 hnorm_data_13
create_bd_pin -dir O -from 127 -to 0 hnorm_data_14
create_bd_pin -dir O -from 127 -to 0 hnorm_data_15
create_bd_pin -dir O -from 127 -to 0 hnorm_data_16
create_bd_pin -dir O -from 127 -to 0 hnorm_data_17
create_bd_pin -dir O -from 127 -to 0 hnorm_data_18
create_bd_pin -dir O -from 127 -to 0 hnorm_data_19
create_bd_pin -dir O -from 127 -to 0 hnorm_data_20
create_bd_pin -dir O -from 127 -to 0 hnorm_data_21
create_bd_pin -dir O -from 127 -to 0 hnorm_data_22
create_bd_pin -dir O -from 127 -to 0 hnorm_data_23
create_bd_pin -dir O -from 127 -to 0 hnorm_data_24
create_bd_pin -dir O -from 127 -to 0 hnorm_data_25
create_bd_pin -dir O -from 127 -to 0 hnorm_data_26
create_bd_pin -dir O -from 127 -to 0 hnorm_data_27
create_bd_pin -dir O -from 127 -to 0 hnorm_data_28
create_bd_pin -dir O -from 127 -to 0 hnorm_data_29
create_bd_pin -dir O -from 127 -to 0 hnorm_data_30
create_bd_pin -dir O -from 127 -to 0 hnorm_data_31
create_bd_pin -dir O -from 127 -to 0 hnorm_data_32
create_bd_pin -dir O -from 127 -to 0 hnorm_data_33
create_bd_pin -dir O -from 127 -to 0 hnorm_data_34
create_bd_pin -dir O -from 127 -to 0 hnorm_data_35
create_bd_pin -dir O -from 127 -to 0 hnorm_data_36
create_bd_pin -dir O -from 127 -to 0 hnorm_data_37
create_bd_pin -dir O -from 127 -to 0 hnorm_data_38
create_bd_pin -dir O -from 127 -to 0 hnorm_data_39
create_bd_pin -dir O -from 127 -to 0 hnorm_data_40
create_bd_pin -dir O -from 127 -to 0 hnorm_data_41
create_bd_pin -dir O -from 127 -to 0 hnorm_data_42
create_bd_pin -dir O -from 127 -to 0 hnorm_data_43
create_bd_pin -dir O -from 127 -to 0 hnorm_data_44
create_bd_pin -dir O -from 127 -to 0 hnorm_data_45
create_bd_pin -dir O -from 127 -to 0 hnorm_data_46
create_bd_pin -dir O -from 127 -to 0 hnorm_data_47
create_bd_pin -dir O -from 127 -to 0 hnorm_data_48
create_bd_pin -dir O -from 127 -to 0 hnorm_data_49
create_bd_pin -dir O -from 127 -to 0 hnorm_data_50
create_bd_pin -dir O -from 127 -to 0 hnorm_data_51
create_bd_pin -dir O -from 127 -to 0 hnorm_data_52
create_bd_pin -dir O -from 127 -to 0 hnorm_data_53
create_bd_pin -dir O -from 127 -to 0 hnorm_data_54
create_bd_pin -dir O -from 127 -to 0 hnorm_data_55
create_bd_pin -dir O -from 127 -to 0 hnorm_data_56
create_bd_pin -dir O -from 127 -to 0 hnorm_data_57
create_bd_pin -dir O -from 127 -to 0 hnorm_data_58
create_bd_pin -dir O -from 127 -to 0 hnorm_data_59
create_bd_pin -dir O -from 127 -to 0 hnorm_data_60
create_bd_pin -dir O -from 127 -to 0 hnorm_data_61
create_bd_pin -dir O -from 127 -to 0 hnorm_data_62
create_bd_pin -dir O -from 127 -to 0 hnorm_data_63
create_bd_pin -dir O -from 127 -to 0 hnorm_data_64
create_bd_pin -dir O -from 127 -to 0 hnorm_data_65
create_bd_pin -dir O -from 127 -to 0 hnorm_data_66
create_bd_pin -dir O -from 127 -to 0 hnorm_data_67
create_bd_pin -dir O -from 127 -to 0 hnorm_data_68
create_bd_pin -dir O -from 127 -to 0 hnorm_data_69
create_bd_pin -dir O -from 127 -to 0 hnorm_data_70
create_bd_pin -dir O -from 127 -to 0 hnorm_data_71
create_bd_pin -dir O -from 127 -to 0 hnorm_data_72
create_bd_pin -dir O -from 127 -to 0 hnorm_data_73
create_bd_pin -dir O -from 127 -to 0 hnorm_data_74
create_bd_pin -dir O -from 127 -to 0 hnorm_data_75
create_bd_pin -dir O -from 127 -to 0 hnorm_data_76
create_bd_pin -dir O -from 127 -to 0 hnorm_data_77
create_bd_pin -dir O -from 127 -to 0 hnorm_data_78
create_bd_pin -dir O -from 127 -to 0 hnorm_data_79
create_bd_pin -dir O -from 127 -to 0 hnorm_data_80
create_bd_pin -dir O -from 127 -to 0 hnorm_data_81
create_bd_pin -dir O -from 127 -to 0 hnorm_data_82
create_bd_pin -dir O -from 127 -to 0 hnorm_data_83
create_bd_pin -dir O -from 127 -to 0 hnorm_data_84
create_bd_pin -dir O -from 127 -to 0 hnorm_data_85
create_bd_pin -dir O -from 127 -to 0 hnorm_data_86
create_bd_pin -dir O -from 127 -to 0 hnorm_data_87
create_bd_pin -dir O -from 127 -to 0 hnorm_data_88
create_bd_pin -dir O -from 127 -to 0 hnorm_data_89
create_bd_pin -dir O -from 127 -to 0 hnorm_data_90
create_bd_pin -dir O -from 127 -to 0 hnorm_data_91
create_bd_pin -dir O -from 127 -to 0 hnorm_data_92
create_bd_pin -dir O -from 127 -to 0 hnorm_data_93
create_bd_pin -dir O -from 127 -to 0 hnorm_data_94
create_bd_pin -dir O -from 127 -to 0 hnorm_data_95
create_bd_pin -dir O -from 127 -to 0 hnorm_data_96
create_bd_pin -dir O -from 127 -to 0 hnorm_data_97
create_bd_pin -dir O -from 127 -to 0 hnorm_data_98
create_bd_pin -dir O -from 127 -to 0 hnorm_data_99
create_bd_pin -dir O -from 127 -to 0 hnorm_data_100
create_bd_pin -dir O -from 127 -to 0 hnorm_data_101
create_bd_pin -dir O -from 127 -to 0 hnorm_data_102
create_bd_pin -dir O -from 127 -to 0 hnorm_data_103
create_bd_pin -dir O -from 127 -to 0 hnorm_data_104
create_bd_pin -dir O -from 127 -to 0 hnorm_data_105
create_bd_pin -dir O -from 127 -to 0 hnorm_data_106
create_bd_pin -dir O -from 127 -to 0 hnorm_data_107
create_bd_pin -dir O -from 127 -to 0 hnorm_data_108
create_bd_pin -dir O -from 127 -to 0 hnorm_data_109
create_bd_pin -dir O -from 127 -to 0 hnorm_data_110
create_bd_pin -dir O -from 127 -to 0 hnorm_data_111
create_bd_pin -dir O -from 127 -to 0 hnorm_data_112
create_bd_pin -dir O -from 127 -to 0 hnorm_data_113
create_bd_pin -dir O -from 127 -to 0 hnorm_data_114
create_bd_pin -dir O -from 127 -to 0 hnorm_data_115
create_bd_pin -dir O -from 127 -to 0 hnorm_data_116
create_bd_pin -dir O -from 127 -to 0 hnorm_data_117
create_bd_pin -dir O -from 127 -to 0 hnorm_data_118
create_bd_pin -dir O -from 127 -to 0 hnorm_data_119
create_bd_pin -dir O -from 127 -to 0 hnorm_data_120
create_bd_pin -dir O -from 127 -to 0 hnorm_data_121
create_bd_pin -dir O -from 127 -to 0 hnorm_data_122
create_bd_pin -dir O -from 127 -to 0 hnorm_data_123
create_bd_pin -dir O -from 127 -to 0 hnorm_data_124
create_bd_pin -dir O -from 127 -to 0 hnorm_data_125
create_bd_pin -dir O -from 127 -to 0 hnorm_data_126
create_bd_pin -dir O -from 127 -to 0 hnorm_data_127

create_bd_cell -type module -reference ChannelNorm ChannelNorm_0
set_property -dict {CONFIG.DIN_W 16 CONFIG.FRAC_W 16 CONFIG.NOISE_W 32 CONFIG.PORT 2} [get_bd_cells ChannelNorm_0]
create_bd_cell -type module -reference ChannelNorm ChannelNorm_1
set_property -dict {CONFIG.DIN_W 16 CONFIG.FRAC_W 16 CONFIG.NOISE_W 32 CONFIG.PORT 2} [get_bd_cells ChannelNorm_1]
create_bd_cell -type module -reference ChannelNorm ChannelNorm_2
set_property -dict {CONFIG.DIN_W 16 CONFIG.FRAC_W 16 CONFIG.NOISE_W 32 CONFIG.PORT 2} [get_bd_cells ChannelNorm_2]
create_bd_cell -type module -reference ChannelNorm ChannelNorm_3
set_property -dict {CONFIG.DIN_W 16 CONFIG.FRAC_W 16 CONFIG.NOISE_W 32 CONFIG.PORT 2} [get_bd_cells ChannelNorm_3]
create_bd_cell -type module -reference ChannelNorm ChannelNorm_4
set_property -dict {CONFIG.DIN_W 16 CONFIG.FRAC_W 16 CONFIG.NOISE_W 32 CONFIG.PORT 2} [get_bd_cells ChannelNorm_4]
create_bd_cell -type module -reference ChannelNorm ChannelNorm_5
set_property -dict {CONFIG.DIN_W 16 CONFIG.FRAC_W 16 CONFIG.NOISE_W 32 CONFIG.PORT 2} [get_bd_cells ChannelNorm_5]
create_bd_cell -type module -reference ChannelNorm ChannelNorm_6
set_property -dict {CONFIG.DIN_W 16 CONFIG.FRAC_W 16 CONFIG.NOISE_W 32 CONFIG.PORT 2} [get_bd_cells ChannelNorm_6]
create_bd_cell -type module -reference ChannelNorm ChannelNorm_7
set_property -dict {CONFIG.DIN_W 16 CONFIG.FRAC_W 16 CONFIG.NOISE_W 32 CONFIG.PORT 2} [get_bd_cells ChannelNorm_7]

# ---- connections ----

current_bd_instance /Demap
connect_bd_net -net Correlation_0_comm_addr [get_bd_pins rdaddr] \
  [get_bd_pins Demap_0/rdaddr] [get_bd_pins Demap_1/rdaddr] [get_bd_pins Demap_2/rdaddr] [get_bd_pins Demap_3/rdaddr] \
  [get_bd_pins Demap_4/rdaddr] [get_bd_pins Demap_5/rdaddr] [get_bd_pins Demap_6/rdaddr] [get_bd_pins Demap_7/rdaddr]
connect_bd_net -net Correlation_0_comm_rden [get_bd_pins rden] \
  [get_bd_pins Demap_0/rden] [get_bd_pins Demap_1/rden] [get_bd_pins Demap_2/rden] [get_bd_pins Demap_3/rden] \
  [get_bd_pins Demap_4/rden] [get_bd_pins Demap_5/rden] [get_bd_pins Demap_6/rden] [get_bd_pins Demap_7/rden]
connect_bd_net [get_bd_pins Demap_0/demap_done] [get_bd_pins demap_done_0]
connect_bd_net [get_bd_pins Demap_0/dout] [get_bd_pins dout_0]
connect_bd_net [get_bd_pins Demap_1/demap_done] [get_bd_pins demap_done_1]
connect_bd_net [get_bd_pins Demap_1/dout] [get_bd_pins dout_1]
connect_bd_net [get_bd_pins Demap_2/demap_done] [get_bd_pins demap_done_2]
connect_bd_net [get_bd_pins Demap_2/dout] [get_bd_pins dout_2]
connect_bd_net [get_bd_pins Demap_3/demap_done] [get_bd_pins demap_done_3]
connect_bd_net [get_bd_pins Demap_3/dout] [get_bd_pins dout_3]
connect_bd_net [get_bd_pins Demap_4/demap_done] [get_bd_pins demap_done_4]
connect_bd_net [get_bd_pins Demap_4/dout] [get_bd_pins dout_4]
connect_bd_net [get_bd_pins Demap_5/demap_done] [get_bd_pins demap_done_5]
connect_bd_net [get_bd_pins Demap_5/dout] [get_bd_pins dout_5]
connect_bd_net [get_bd_pins Demap_6/demap_done] [get_bd_pins demap_done_6]
connect_bd_net [get_bd_pins Demap_6/dout] [get_bd_pins dout_6]
connect_bd_net [get_bd_pins Demap_7/demap_done] [get_bd_pins demap_done_7]
connect_bd_net [get_bd_pins Demap_7/dout] [get_bd_pins dout_7]
connect_bd_net -net MuxPDU_0_srs_NrOfSymbols [get_bd_pins NumSRSSymbols] \
  [get_bd_pins Demap_0/NumSRSSymbols] [get_bd_pins Demap_1/NumSRSSymbols] [get_bd_pins Demap_2/NumSRSSymbols] \
  [get_bd_pins Demap_3/NumSRSSymbols] [get_bd_pins Demap_4/NumSRSSymbols] [get_bd_pins Demap_5/NumSRSSymbols] \
  [get_bd_pins Demap_6/NumSRSSymbols] [get_bd_pins Demap_7/NumSRSSymbols]
connect_bd_net -net MuxPDU_0_srs_StartPos [get_bd_pins SymbolStart] \
  [get_bd_pins Demap_0/SymbolStart] [get_bd_pins Demap_1/SymbolStart] [get_bd_pins Demap_2/SymbolStart] \
  [get_bd_pins Demap_3/SymbolStart] [get_bd_pins Demap_4/SymbolStart] [get_bd_pins Demap_5/SymbolStart] \
  [get_bd_pins Demap_6/SymbolStart] [get_bd_pins Demap_7/SymbolStart]
connect_bd_net -net clk_0_1 [get_bd_pins clk] \
  [get_bd_pins Demap_0/clk] [get_bd_pins Demap_1/clk] [get_bd_pins Demap_2/clk] [get_bd_pins Demap_3/clk] \
  [get_bd_pins Demap_4/clk] [get_bd_pins Demap_5/clk] [get_bd_pins Demap_6/clk] [get_bd_pins Demap_7/clk]
connect_bd_net -net fft_data_0_1 [get_bd_pins fft_data_0] [get_bd_pins Demap_0/fft_data]
connect_bd_net -net fft_data_1_1 [get_bd_pins fft_data_1] [get_bd_pins Demap_1/fft_data]
connect_bd_net -net fft_data_2_1 [get_bd_pins fft_data_2] [get_bd_pins Demap_2/fft_data]
connect_bd_net -net fft_data_3_1 [get_bd_pins fft_data_3] [get_bd_pins Demap_3/fft_data]
connect_bd_net -net fft_data_4_1 [get_bd_pins fft_data_4] [get_bd_pins Demap_4/fft_data]
connect_bd_net -net fft_data_5_1 [get_bd_pins fft_data_5] [get_bd_pins Demap_5/fft_data]
connect_bd_net -net fft_data_6_1 [get_bd_pins fft_data_6] [get_bd_pins Demap_6/fft_data]
connect_bd_net -net fft_data_7_1 [get_bd_pins fft_data_7] [get_bd_pins Demap_7/fft_data]
connect_bd_net -net fft_valid_0_1 [get_bd_pins fft_valid] \
  [get_bd_pins Demap_0/fft_valid] [get_bd_pins Demap_1/fft_valid] [get_bd_pins Demap_2/fft_valid] \
  [get_bd_pins Demap_3/fft_valid] [get_bd_pins Demap_4/fft_valid] [get_bd_pins Demap_5/fft_valid] \
  [get_bd_pins Demap_6/fft_valid] [get_bd_pins Demap_7/fft_valid]
connect_bd_net -net rstn_0_1 [get_bd_pins rstn] \
  [get_bd_pins Demap_0/rstn] [get_bd_pins Demap_1/rstn] [get_bd_pins Demap_2/rstn] [get_bd_pins Demap_3/rstn] \
  [get_bd_pins Demap_4/rstn] [get_bd_pins Demap_5/rstn] [get_bd_pins Demap_6/rstn] [get_bd_pins Demap_7/rstn]
connect_bd_net -net symbIdx_0_1 [get_bd_pins symbIdx] \
  [get_bd_pins Demap_0/symbIdx] [get_bd_pins Demap_1/symbIdx] [get_bd_pins Demap_2/symbIdx] [get_bd_pins Demap_3/symbIdx] \
  [get_bd_pins Demap_4/symbIdx] [get_bd_pins Demap_5/symbIdx] [get_bd_pins Demap_6/symbIdx] [get_bd_pins Demap_7/symbIdx]
